# Altium schematic sheet STM32L.SchDoc
size A4; DocumentNumber: 3; Revision: C.1(PCB.SCH); SheetNumber: 3; SheetTotal: 6
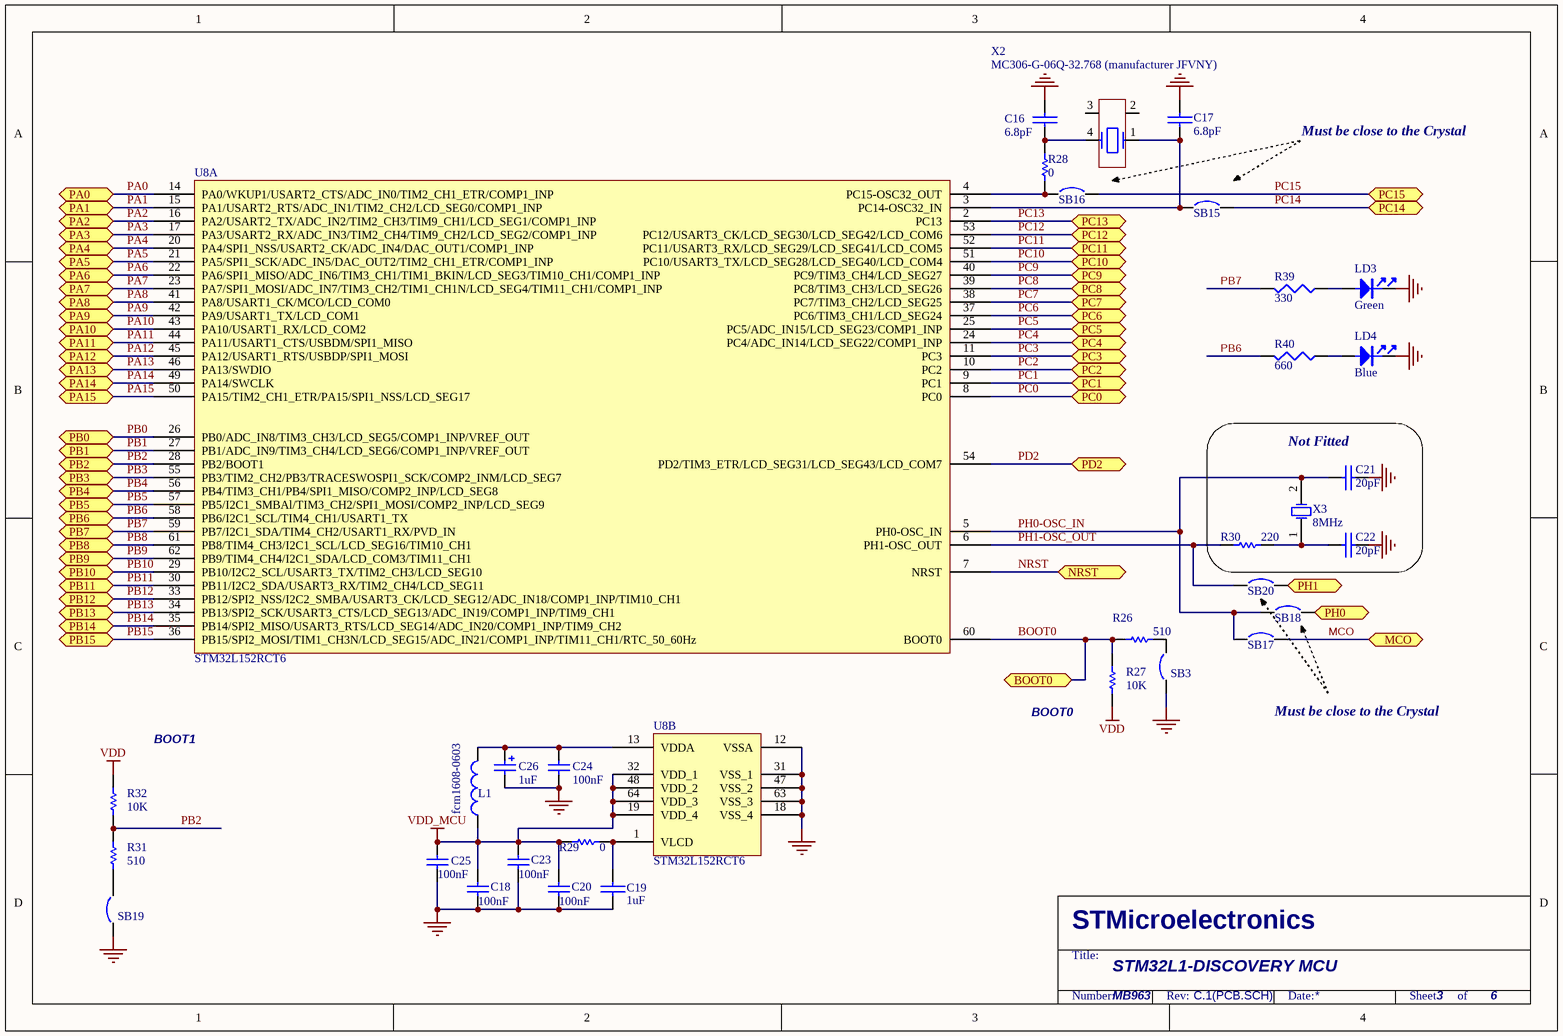
[diagram p0: STM32L.SchDoc]

## Parts
C16  6.8pF  [0603C]
C17  6.8pF  [0603C]
C18  100nF  [0402C]
C19  1uF  [0603C]
C20  100nF  [0402C]
C21  20pF  [0603C]
C22  20pF  [0603C]
C23  100nF  [0402C]
C24  100nF  [0402C]
C25  100nF  [0402C]
C26  1uF  [CASE-AA]
L1  fcm1608-0603  [0603L]
LD3  Green  [0603D]
LD4  Blue  [0603D]
R26  510  [0603R]
R27  10K  [0402R]
R28  0  [0603R]
R29  0  [0402R]
R30  220  [0603R]
R31  510  [0603R]
R32  10K  [0402R]
R39  330  [0603R]
R40  660  [0603R]
SB3  Circuit Breaker  [JP2_SMD]  (value not drawn)
SB15  Circuit Breaker  [JP2_SMD]  (value not drawn)
SB16  Circuit Breaker  [JP2_SMD]  (value not drawn)
SB17  Circuit Breaker  [JP2_SMD]  (value not drawn)
SB18  Circuit Breaker  [JP2_SMD]  (value not drawn)
SB19  Circuit Breaker  [JP2_SMD]  (value not drawn)
SB20  Circuit Breaker  [JP2_SMD]  (value not drawn)
U8  STM32L152RCT6  [QFP64]  (parts A,B of 2)
X2  MC306-G-06Q-32.768 (manufacturer JFVNY)  [MC306-CRYSTAL]
X3  8MHz  [XTAL1]

## Blocks framed on the sheet
Not Fitted: C21 C22 R30 X3

## Ports
BOOT0, MCO, NRST, PA0 (bidir), PA1 (bidir), PA2 (bidir), PA3 (bidir), PA4 (bidir), PA5 (bidir), PA6 (bidir), PA7 (bidir), PA8 (bidir), PA9 (bidir), PA10 (bidir), PA11 (bidir), PA12 (bidir), PA13 (bidir), PA14 (bidir), PA15 (bidir), PB0 (bidir), PB1 (bidir), PB2 (bidir), PB3 (bidir), PB4 (bidir), PB5 (bidir), PB6 (bidir), PB7 (bidir), PB8 (bidir), PB9 (bidir), PB10 (bidir), PB11 (bidir), PB12 (bidir), PB13 (bidir), PB14 (bidir), PB15 (bidir), PC0 (bidir), PC1 (bidir), PC2 (bidir), PC3 (bidir), PC4 (bidir), PC5 (bidir), PC6 (bidir), PC7 (bidir), PC8 (bidir), PC9 (bidir), PC10 (bidir), PC11 (bidir), PC12 (bidir), PC13 (bidir), PC14 (bidir), PC15 (bidir), PD2, PH0, PH1

## Nets
GND: C16.2 C17.2 C18.1 C19.2 C20.1 C21.1 C22.1 C23.2 C24.1 C25.1 C26.2 LD3.2 LD4.2 SB3.1 SB19.1 U8.12(VSSA) U8.18(VSS_4) U8.31(VSS_1) U8.47(VSS_2) U8.63(VSS_3)
VDD: R27.2 R32.1
VDD_MCU: C18.2 C20.2 C23.1 C25.2 L1.1 R29.1 U8.19(VDD_4) U8.32(VDD_1) U8.48(VDD_2) U8.64(VDD_3)
BOOT0: R26.2 R27.1 U8.60(BOOT0) ; port BOOT0
MCO: SB17.2 ; port MCO
NRST: U8.7(NRST) ; port NRST
PA0: U8.14(PA0/WKUP1/USART2_CTS/ADC_IN0/TIM2_CH1_ETR/COMP1_INP) ; port PA0
PA1: U8.15(PA1/USART2_RTS/ADC_IN1/TIM2_CH2/LCD_SEG0/COMP1_INP) ; port PA1
PA2: U8.16(PA2/USART2_TX/ADC_IN2/TIM2_CH3/TIM9_CH1/LCD_SEG1/COMP1_INP) ; port PA2
PA3: U8.17(PA3/USART2_RX/ADC_IN3/TIM2_CH4/TIM9_CH2/LCD_SEG2/COMP1_INP) ; port PA3
PA4: U8.20(PA4/SPI1_NSS/USART2_CK/ADC_IN4/DAC_OUT1/COMP1_INP) ; port PA4
PA5: U8.21(PA5/SPI1_SCK/ADC_IN5/DAC_OUT2/TIM2_CH1_ETR/COMP1_INP) ; port PA5
PA6: U8.22(PA6/SPI1_MISO/ADC_IN6/TIM3_CH1/TIM1_BKIN/LCD_SEG3/TIM10_CH1/COMP1_INP) ; port PA6
PA7: U8.23(PA7/SPI1_MOSI/ADC_IN7/TIM3_CH2/TIM1_CH1N/LCD_SEG4/TIM11_CH1/COMP1_INP) ; port PA7
PA8: U8.41(PA8/USART1_CK/MCO/LCD_COM0) ; port PA8
PA9: U8.42(PA9/USART1_TX/LCD_COM1) ; port PA9
PA10: U8.43(PA10/USART1_RX/LCD_COM2) ; port PA10
PA11: U8.44(PA11/USART1_CTS/USBDM/SPI1_MISO) ; port PA11
PA12: U8.45(PA12/USART1_RTS/USBDP/SPI1_MOSI) ; port PA12
PA13: U8.46(PA13/SWDIO) ; port PA13
PA14: U8.49(PA14/SWCLK) ; port PA14
PA15: U8.50(PA15/TIM2_CH1_ETR/PA15/SPI1_NSS/LCD_SEG17) ; port PA15
PB0: U8.26(PB0/ADC_IN8/TIM3_CH3/LCD_SEG5/COMP1_INP/VREF_OUT) ; port PB0
PB1: U8.27(PB1/ADC_IN9/TIM3_CH4/LCD_SEG6/COMP1_INP/VREF_OUT) ; port PB1
PB2: R31.1 R32.2 U8.28(PB2/BOOT1) ; port PB2
PB3: U8.55(PB3/TIM2_CH2/PB3/TRACESWOSPI1_SCK/COMP2_INM/LCD_SEG7) ; port PB3
PB4: U8.56(PB4/TIM3_CH1/PB4/SPI1_MISO/COMP2_INP/LCD_SEG8) ; port PB4
PB5: U8.57(PB5/I2C1_SMBAl/TIM3_CH2/SPI1_MOSI/COMP2_INP/LCD_SEG9) ; port PB5
PB6: R40.2 U8.58(PB6/I2C1_SCL/TIM4_CH1/USART1_TX) ; port PB6
PB7: R39.2 U8.59(PB7/I2C1_SDA/TIM4_CH2/USART1_RX/PVD_IN) ; port PB7
PB8: U8.61(PB8/TIM4_CH3/I2C1_SCL/LCD_SEG16/TIM10_CH1) ; port PB8
PB9: U8.62(PB9/TIM4_CH4/I2C1_SDA/LCD_COM3/TIM11_CH1) ; port PB9
PB10: U8.29(PB10/I2C2_SCL/USART3_TX/TIM2_CH3/LCD_SEG10) ; port PB10
PB11: U8.30(PB11/I2C2_SDA/USART3_RX/TIM2_CH4/LCD_SEG11) ; port PB11
PB12: U8.33(PB12/SPI2_NSS/I2C2_SMBA/USART3_CK/LCD_SEG12/ADC_IN18/COMP1_INP/TIM10_CH1) ; port PB12
PB13: U8.34(PB13/SPI2_SCK/USART3_CTS/LCD_SEG13/ADC_IN19/COMP1_INP/TIM9_CH1) ; port PB13
PB14: U8.35(PB14/SPI2_MISO/USART3_RTS/LCD_SEG14/ADC_IN20/COMP1_INP/TIM9_CH2) ; port PB14
PB15: U8.36(PB15/SPI2_MOSI/TIM1_CH3N/LCD_SEG15/ADC_IN21/COMP1_INP/TIM11_CH1/RTC_50_60Hz) ; port PB15
PC0: U8.8(PC0) ; port PC0
PC1: U8.9(PC1) ; port PC1
PC2: U8.10(PC2) ; port PC2
PC3: U8.11(PC3) ; port PC3
PC4: U8.24(PC4/ADC_IN14/LCD_SEG22/COMP1_INP) ; port PC4
PC5: U8.25(PC5/ADC_IN15/LCD_SEG23/COMP1_INP) ; port PC5
PC6: U8.37(PC6/TIM3_CH1/LCD_SEG24) ; port PC6
PC7: U8.38(PC7/TIM3_CH2/LCD_SEG25) ; port PC7
PC8: U8.39(PC8/TIM3_CH3/LCD_SEG26) ; port PC8
PC9: U8.40(PC9/TIM3_CH4/LCD_SEG27) ; port PC9
PC10: U8.51(PC10/USART3_TX/LCD_SEG28/LCD_SEG40/LCD_COM4) ; port PC10
PC11: U8.52(PC11/USART3_RX/LCD_SEG29/LCD_SEG41/LCD_COM5) ; port PC11
PC12: U8.53(PC12/USART3_CK/LCD_SEG30/LCD_SEG42/LCD_COM6) ; port PC12
PC13: U8.2(PC13) ; port PC13
PC14: SB15.2 ; port PC14
PC15: SB16.2 ; port PC15
PD2: U8.54(PD2/TIM3_ETR/LCD_SEG31/LCD_SEG43/LCD_COM7) ; port PD2
PH0: SB18.2 ; port PH0
PH0-OSC_IN: C21.2 SB17.1 SB18.1 U8.5(PH0-OSC_IN) X3.2(OSC2)
PH1: SB20.2 ; port PH1
PH1-OSC_OUT: R30.2 SB20.1 U8.6(PH1-OSC_OUT)
NetC16_1: C16.1 R28.1 X2.4
NetC17_1: C17.1 SB15.1 U8.3(PC14-OSC32_IN) X2.1
NetC19_1: C19.1 R29.2 U8.1(VLCD)
NetC22_2: C22.2 R30.1 X3.1(OSC1)
NetC24_2: C24.2 C26.1 L1.2 U8.13(VDDA)
NetLD3_1: LD3.1 R39.1
NetLD4_1: LD4.1 R40.1
NetR26_1: R26.1 SB3.2
NetR28_2: R28.2 SB16.1 U8.4(PC15-OSC32_OUT)
NetR31_2: R31.2 SB19.2

Not connected (* = marked no-connect by the designer): X2 2 3

## Notes on the sheet
- Must be close to the Crystal
- (near R27) BOOT0
- BOOT1
- STM32L1-DISCOVERY MCU
- MB963
- STMicroelectronics
- Title:
- Number:
- Rev:
- Date:
- Sheet       of

## Library data of the parts
C16 C17 C19 = CAP: Capacitor
  C16 C17: Value: 6.8pF
  C19: Value: 1uF
C18 C20 C23-C25 = Cap: Capacitor; Published: 8-Jun-2000; Revision: July-2002: Re-released for DXP Platform.; Publisher: Altium Limited; Value: 100nF
C21 C22 = CAP: Capacitor; Fitted: NO; Value: 20pF
C26 = Cap Pol1: Polarized Capacitor (Radial); Value: 10uF; Published: 8-Jun-2000; Revision: July-2002: Re-released for DXP Platform.; Publisher: Altium Limited
L1 = Inductor: Value: 100uH; Published: 8-Jun-2000; Revision: July-2002: Re-released for DXP Platform.; Publisher: Altium Limited
LD3 LD4 = PHOTO
R26 R28 = Res1: Resistor; Published: 8-Jun-2000; Revision: July-2002: Re-released for DXP Platform.; Publisher: Altium Limited
  R26: Value: 510
  R28: Value: 0
R27 R31 R32 = res1: Resistor; Published: 8-Jun-2000; Revision: July-2002: Re-released for DXP Platform.; Publisher: Altium Limited
  R27 R32: Value: 10K
  R31: Value: 510
R29 = res1: Resistor; Fitted: NO; Published: 8-Jun-2000; Revision: July-2002: Re-released for DXP Platform.; Publisher: Altium Limited; Value: 0
R30 = Res1: Resistor; Fitted: NO; Published: 8-Jun-2000; Revision: July-2002: Re-released for DXP Platform.; Publisher: Altium Limited; Value: 220
R39 R40 = RES1
  R39: Value: 330
  R40: Value: 660
SB3 SB20 = Circuit Breaker: Solder: YES; Published: 24-Mar-1999; Revision: July-2002: Re-released for DXP Platform.; Publisher: Altium Limited
SB15-SB19 = Circuit Breaker: Solder: NO; Published: 24-Mar-1999; Revision: July-2002: Re-released for DXP Platform.; Publisher: Altium Limited
U8 = STM32L152RCT6: 32-bit 256K MCU (SCORPIO2 Shrink); Manufaturer_1: STM; Provided: ST; X3 code: 9175126; ECCN US: 3A991A2; ECCN EU: NEC; Order: STM32L152RCT6; Manufacturer_Part_1: STM32L152RCT6
X2 = MC306
X3 = XTAL: Crystal Oscillator; Fitted: NO; Published: 8-Jun-2000; LatestRevisionDate: 17-Jul-2002; LatestRevisionNote: Re-released for DXP Platform.; PackageReference: R38; Publisher: Altium Limited